# EAGLE design line_sensor (EAGLE 9.6.0)
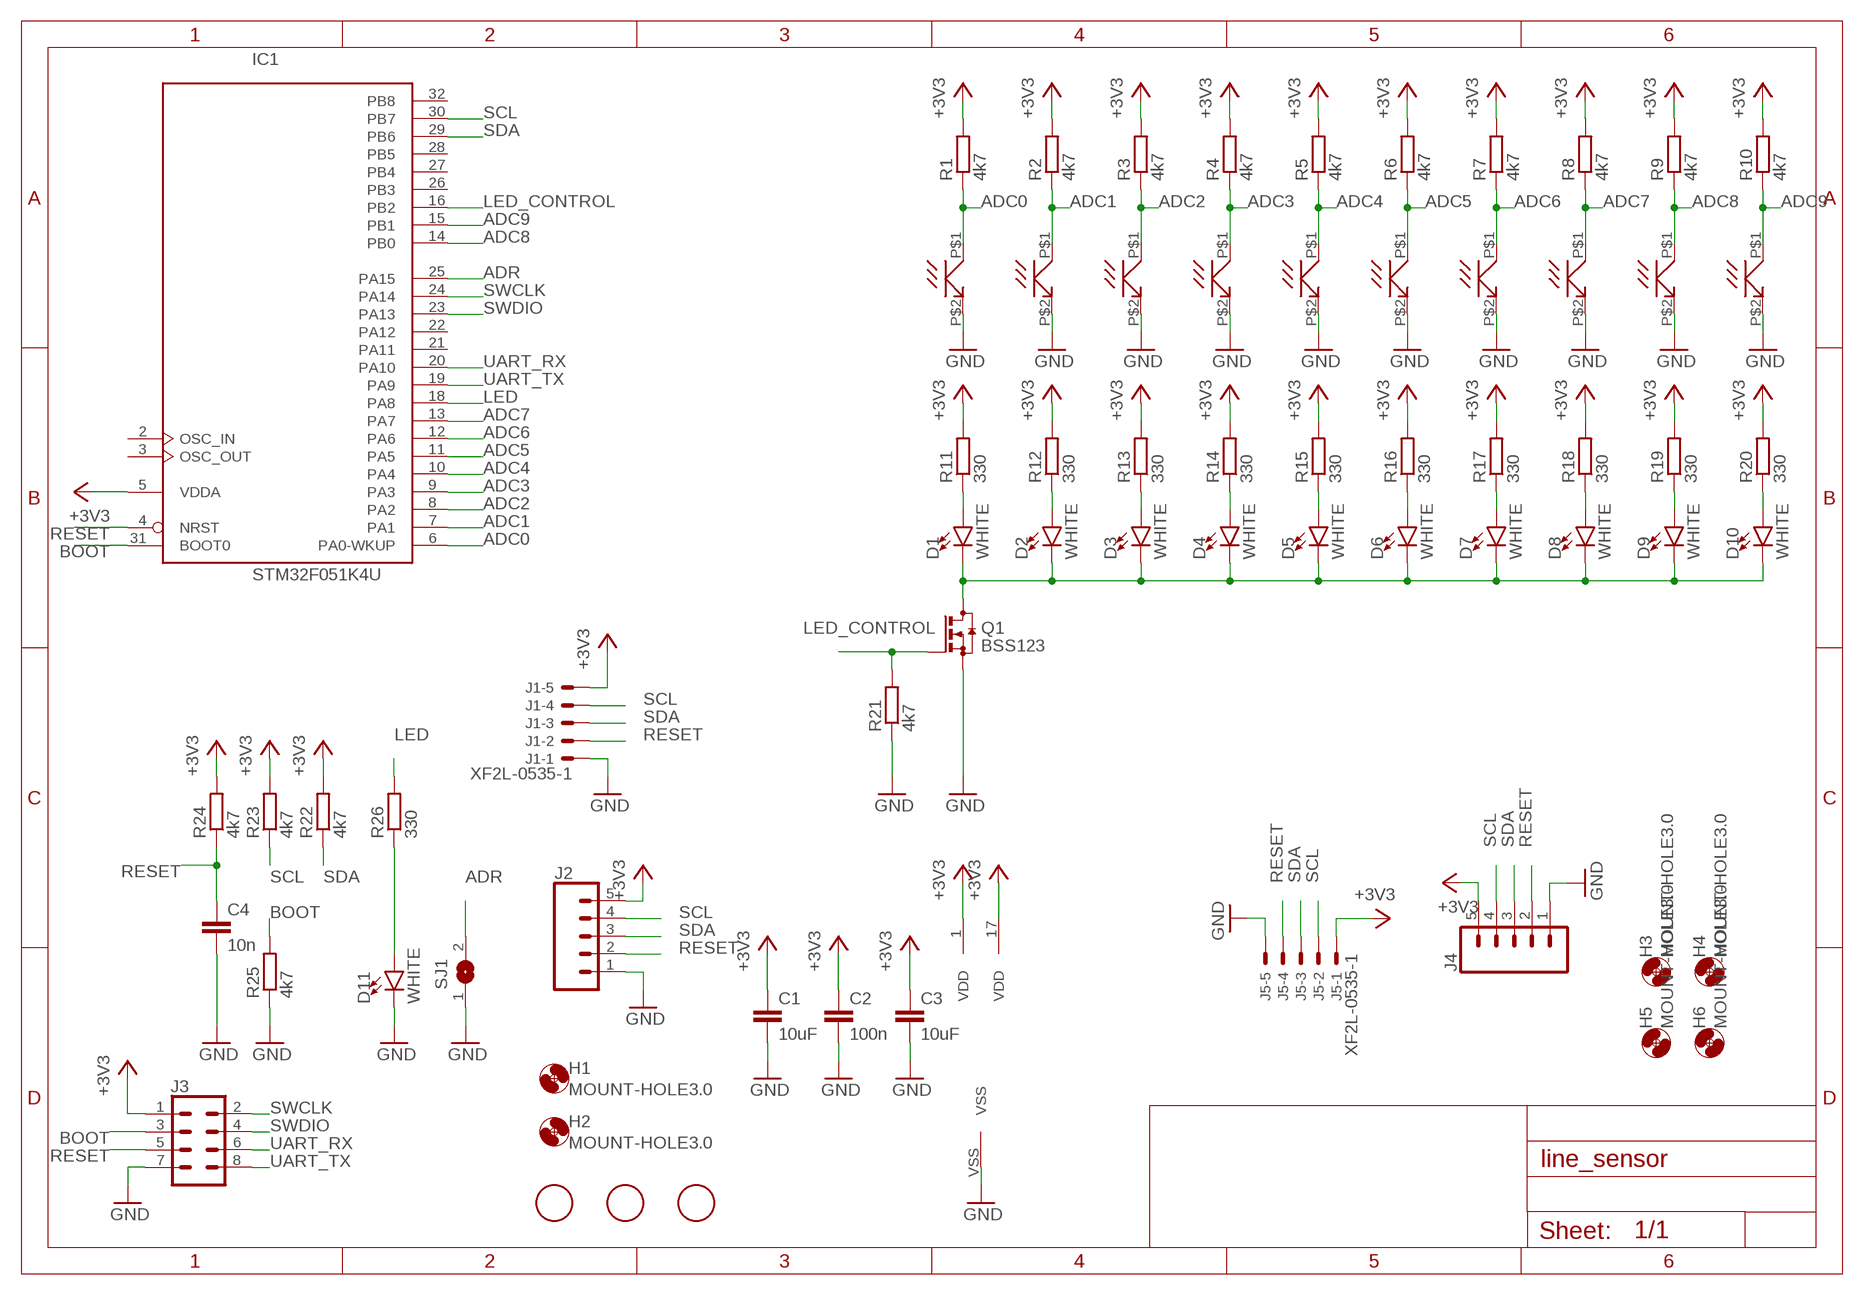
[diagram p0: schematic, sheet 1]

## Parts
C1  10uF  C-EUC0805K  [C0805K]
C2  100n  C-EUC0805K  [C0805K]
C3  10uF  C-EUC0805K  [C0805K]
C4  10n  C-EUC0805K  [C0805K]
D1  WHITE  LED-WHITE1206  [LED-1206]
D2  WHITE  LED-WHITE1206  [LED-1206]
D3  WHITE  LED-WHITE1206  [LED-1206]
D4  WHITE  LED-WHITE1206  [LED-1206]
D5  WHITE  LED-WHITE1206  [LED-1206]
D6  WHITE  LED-WHITE1206  [LED-1206]
D7  WHITE  LED-WHITE1206  [LED-1206]
D8  WHITE  LED-WHITE1206  [LED-1206]
D9  WHITE  LED-WHITE1206  [LED-1206]
D10  WHITE  LED-WHITE1206  [LED-1206]
D11  WHITE  LED-WHITE1206  [LED-1206]
H1  MOUNT-HOLE3.0  [3,0]
H2  MOUNT-HOLE3.0  [3,0]
H3  MOUNT-HOLE3.0  [3,0]
H4  MOUNT-HOLE3.0  [3,0]
H5  MOUNT-HOLE3.0  [3,0]
H6  MOUNT-HOLE3.0  [3,0]
IC1  STM32F051K4U  [UFQFPN32]
J1  XF2L-0535-1  [XF2L-0535-1]
J2  CONN_05  [1X05]
J3  CONN_04X2  [2X4]
J4  CONN_05  [1X05]
J5  XF2L-0535-1  [XF2L-0535-1]
Q1  BSS123  [SOT23]
R1  4k7  R-EU_M0805  [M0805]
R2  4k7  R-EU_M0805  [M0805]
R3  4k7  R-EU_M0805  [M0805]
R4  4k7  R-EU_M0805  [M0805]
R5  4k7  R-EU_M0805  [M0805]
R6  4k7  R-EU_M0805  [M0805]
R7  4k7  R-EU_M0805  [M0805]
R8  4k7  R-EU_M0805  [M0805]
R9  4k7  R-EU_M0805  [M0805]
R10  4k7  R-EU_M0805  [M0805]
R11  330  R-EU_M0805  [M0805]
R12  330  R-EU_M0805  [M0805]
R13  330  R-EU_M0805  [M0805]
R14  330  R-EU_M0805  [M0805]
R15  330  R-EU_M0805  [M0805]
R16  330  R-EU_M0805  [M0805]
R17  330  R-EU_M0805  [M0805]
R18  330  R-EU_M0805  [M0805]
R19  330  R-EU_M0805  [M0805]
R20  330  R-EU_M0805  [M0805]
R21  4k7  R-EU_M0805  [M0805]
R22  4k7  R-EU_M0805  [M0805]
R23  4k7  R-EU_M0805  [M0805]
R24  4k7  R-EU_M0805  [M0805]
R25  4k7  R-EU_M0805  [M0805]
R26  330  R-EU_M0805  [M0805]
SJ1  SJ  [SJ]
U$1  SFH3710  [SFH710]
U$2  SFH3710  [SFH710]
U$3  SFH3710  [SFH710]
U$4  SFH3710  [SFH710]
U$5  SFH3710  [SFH710]
U$6  SFH3710  [SFH710]
U$7  SFH3710  [SFH710]
U$8  SFH3710  [SFH710]
U$9  SFH3710  [SFH710]
U$10  SFH3710  [SFH710]
U$11  FIDUCIAL  [FIDUCIAL_1MM]
U$12  FIDUCIAL  [FIDUCIAL_1MM]
U$13  FIDUCIAL  [FIDUCIAL_1MM]

## Nets
+3V3: C1.1 C2.1 C3.1 IC1.1(VDD) IC1.5(VDDA) IC1.17(VDD) J1.5 J2.5 J3.1 J4.5 J5.1 R1.2 R2.2 R3.2 R4.2 R5.2 R6.2 R7.2 R8.2 R9.2 R10.2 R11.2 R12.2 R13.2 R14.2 R15.2 R16.2 R17.2 R18.2 R19.2 R20.2 R22.2 R23.2 R24.2
ADC0: IC1.6(PA0-WKUP) R1.1 U$1.P$1(C)
ADC1: IC1.7(PA1) R2.1 U$2.P$1(C)
ADC2: IC1.8(PA2) R3.1 U$3.P$1(C)
ADC3: IC1.9(PA3) R4.1 U$4.P$1(C)
ADC4: IC1.10(PA4) R5.1 U$5.P$1(C)
ADC5: IC1.11(PA5) R6.1 U$6.P$1(C)
ADC6: IC1.12(PA6) R7.1 U$7.P$1(C)
ADC7: IC1.13(PA7) R8.1 U$8.P$1(C)
ADC8: IC1.14(PB0) R9.1 U$9.P$1(C)
ADC9: IC1.15(PB1) R10.1 U$10.P$1(C)
ADR: IC1.25(PA15) SJ1.2
BOOT: IC1.31(BOOT0) J3.3 R25.2
GND: C1.2 C2.2 C3.2 C4.2 D11.C IC1.VSS J1.1 J2.1 J3.7 J4.1 J5.5 Q1.2(S) R21.1 R25.1 SJ1.1 U$1.P$2(E) U$2.P$2(E) U$3.P$2(E) U$4.P$2(E) U$5.P$2(E) U$6.P$2(E) U$7.P$2(E) U$8.P$2(E) U$9.P$2(E) U$10.P$2(E)
LED: IC1.18(PA8) R26.2
LED_CONTROL: IC1.16(PB2) Q1.1(G) R21.2
N$1: D1.A R11.1
N$2: D2.A R12.1
N$3: D3.A R13.1
N$4: D4.A R14.1
N$5: D5.A R15.1
N$6: D6.A R16.1
N$7: D7.A R17.1
N$8: D8.A R18.1
N$9: D9.A R19.1
N$10: D10.A R20.1
N$11: D1.C D2.C D3.C D4.C D5.C D6.C D7.C D8.C D9.C D10.C Q1.3(D)
N$12: D11.A R26.1
RESET: C4.1 IC1.4(NRST) J1.2 J2.2 J3.5 J4.2 J5.4 R24.1
SCL: IC1.30(PB7) J1.4 J2.4 J4.4 J5.2 R23.1
SDA: IC1.29(PB6) J1.3 J2.3 J4.3 J5.3 R22.1
SWCLK: IC1.24(PA14) J3.2
SWDIO: IC1.23(PA13) J3.4
UART_RX: IC1.20(PA10) J3.6
UART_TX: IC1.19(PA9) J3.8
Unconnected: IC1.2(OSC_IN) IC1.3(OSC_OUT) IC1.21(PA11) IC1.22(PA12) IC1.26(PB3) IC1.27(PB4) IC1.28(PB5) IC1.32(PB8)

## Library data of the parts
C1-C4 = rcl:C-EU: CAPACITOR, European symbol; SPICEPREFIX: C
D1-D11 = SparkFun-LED:LED-WHITE: White SMD LED Used in manufacturing several products at SparkFun. Packages: 0603 - Bright White SMD 0603 package[Product Link] <http://www.kingbrightusa.com/product.asp?catalog_name=LED&product_id=APT1608QWF/D> 1206 - Bright White SMD1206 package [Product Link] <http://www.kingbrightusa.com/product.asp?catalog_name=LED&product_id=APT3216QWF/D> 3014 - Super Bright SMD 3014 package [Datasheet] <http://www.lumileds.com/uploads/459/DS208-pdf> SparkFun Products: Blackberry Trackballer Breakout <https://www.sparkfun.com/products/13169> Digital SandBox <https://www.sparkfun.com/products/12651>; PROD_ID: DIO-09955
H1-H6 = holes:MOUNT-HOLE: MOUNTING HOLE with drill center marker
IC1 = micro-stm_v3:STM32F051K*U: ARM 32-bit Cortex™-M0 CPU 48 MHz maximum frequency 16 to 64 Kbytes of Flash memory 4 to 8 kbytes of SRAM 27 GPIOs 2.0 to 3.6 V application supply
J1 J5 = con-omron:XF2*-05?: OMRON FPC Connector Source : http://www.omron.com/ecb/products/pdf/fpc.pdf; MPN: XF2L-0535-1A; OC_FARNELL: unknown; OC_NEWARK: 37M0863
J2 J4 = SparkFun-Connectors:CONN_05: Multi connection point. Often used as Generic Header-pin footprint for 0.1 inch spaced/style header connections On any of the 0.1 inch spaced packages, you can populate with these: Break Away Headers - Straight <https://www.sparkfun.com/products/116> (PRT-00116) Break Away Male Headers - Right Angle <https://www.sparkfun.com/products/553> (PRT-00553) Female Headers <https://www.sparkfun.com/products/115> (PRT-00115) Break Away Headers - Machine Pin <https://www.sparkfun.com/products/117> (PRT-00117) Break Away Female Headers - Swiss Machine Pin <https://www.sparkfun.com/products/743> (PRT-00743) For SCREWTERMINALS and SPRING TERMINALS visit here: Screw Terimnals on SparkFun.com <https://www.sparkfun.com/search/results?term=Screw+Terminals> (5mm/3.5mm/2.54mm spacing) This device is also useful as a general connection point to wire up your design to another part of your project. Our various solder wires solder well into these plated through hole pads. Hook-Up Wire - Assortment (Stranded, 22 AWG) <https://www.sparkfun.com/products/11375> (PRT-11375) Hook-Up Wire - Assortment (Solid Core, 22 AWG) <https://www.sparkfun.com/products/11367> (PRT-11367) View the entire wire category on our website here <https://www.sparkfun.com/categories/141> Special notes: Molex polarized connector foot print use with SKU : PRT-08231 with associated crimp pins and housings. 1MM SMD Version SKU: PRT-10208
J3 = SparkFun-Connectors:CONN_04X2: Multi connection point. Often used as Generic Header-pin footprint for 0.1 inch spaced/style header connections On any of the 0.1 inch spaced packages, you can populate with these: Break Away Headers - Straight <https://www.sparkfun.com/products/116> (PRT-00116) Break Away Male Headers - Right Angle <https://www.sparkfun.com/products/553> (PRT-00553) Female Headers <https://www.sparkfun.com/products/115> (PRT-00115) Break Away Headers - Machine Pin <https://www.sparkfun.com/products/117> (PRT-00117) Break Away Female Headers - Swiss Machine Pin <https://www.sparkfun.com/products/743> (PRT-00743)
Q1 = transistor-small-signal:BSS123: N-CHANNEL MOS FET
R1-R26 = rcl:R-EU_: RESISTOR, European symbol; SPICEPREFIX: R
SJ1 = jumper:SJ: SMD solder JUMPER
U$1-U$10 = my_library:SFH3710
U$11-U$13 = borkedlabs-misc:FIDUCIAL: For use by pick and place machines to calibrate the vision/machine, 1mm By microbuilder.eu

## Board
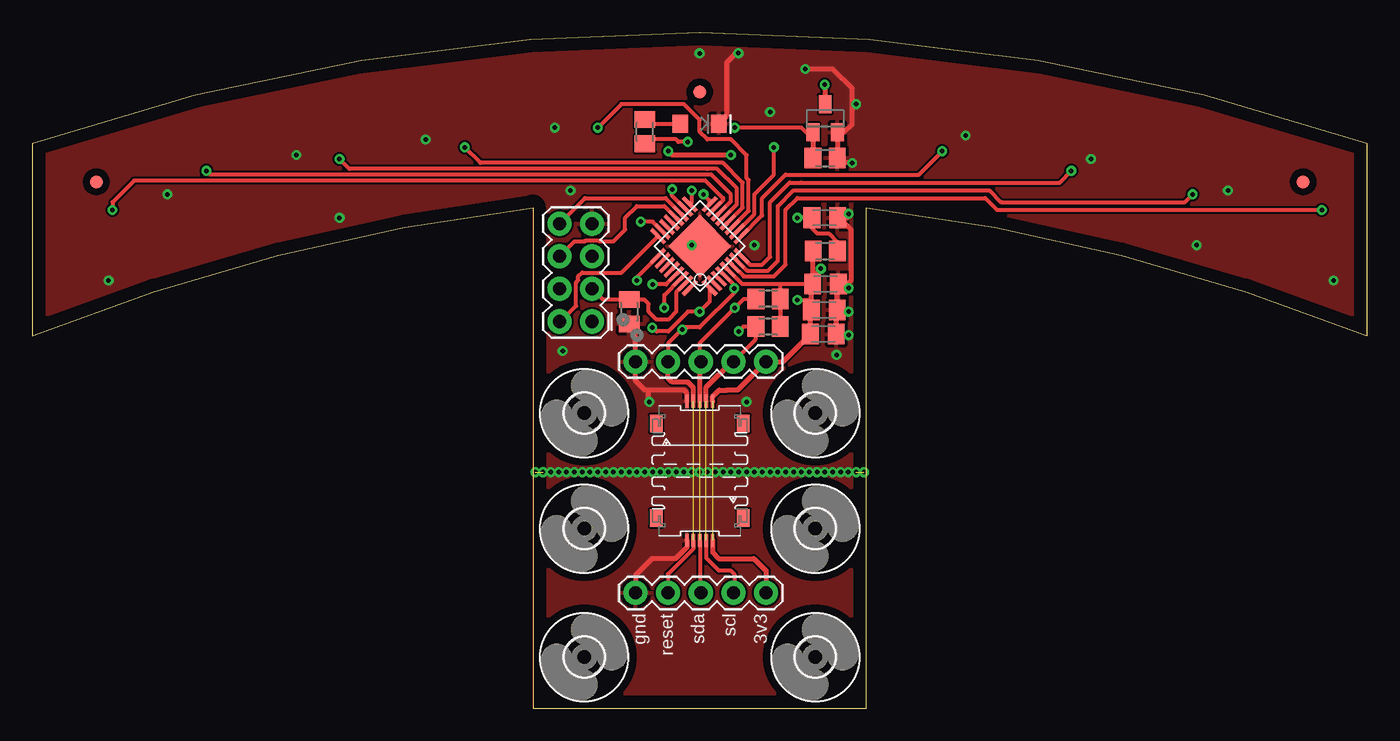
[diagram p1: board, top side]
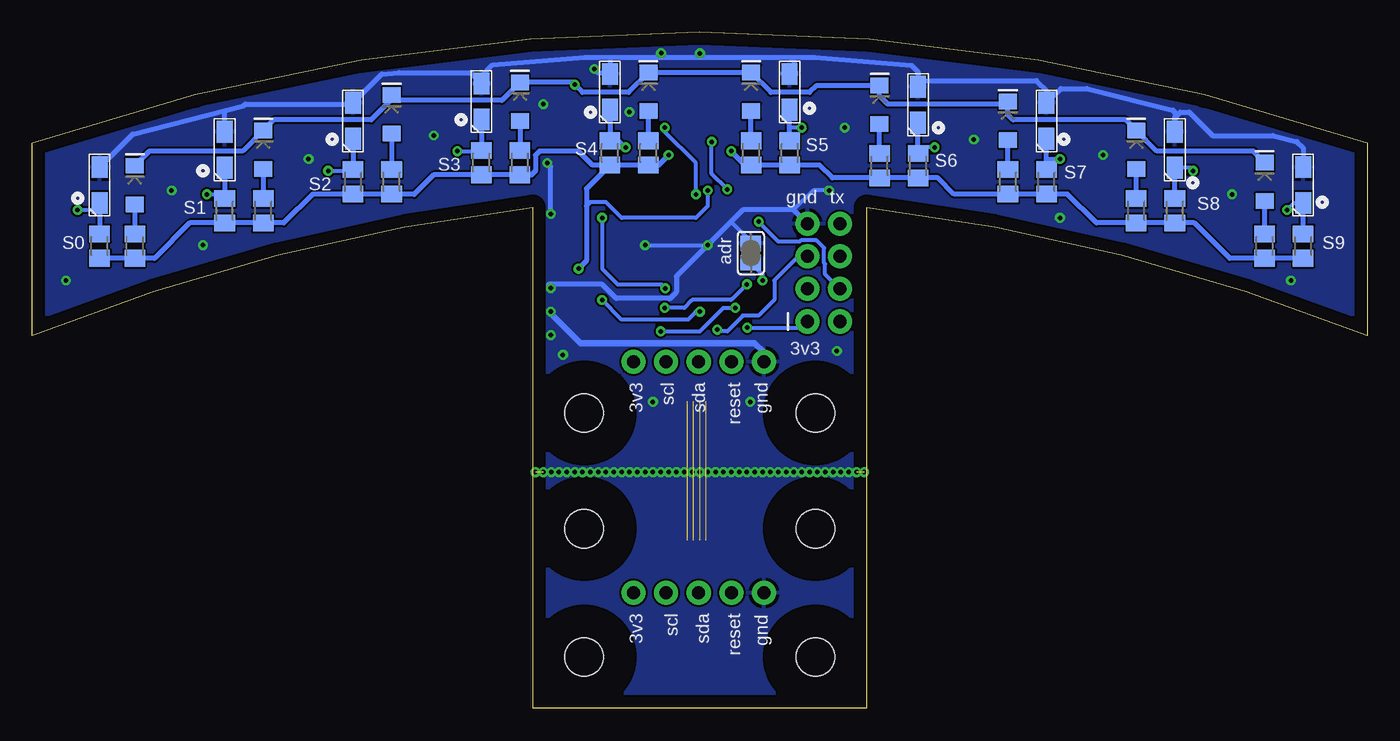
[diagram p2: board, bottom side, seen from below]

Size 104 x 52.66 mm. Coordinates in mm from the lower left corner, seen from the top.
Outline: 39,0 65,0 65,39 arc-15 104,29 104,44 arc38 0,44 0,29 arc-15 39,39 39,0
Copper layers (1*16): Top 0.035mm / dielectric 1.5mm / Bottom 0.035mm
Design rules "default": minimum track width 6mil, minimum drill 0.35mm, track to track 6mil, track to pad 6mil, pad to pad 6mil, via to via 6mil, smd to smd 6mil, copper to edge 40mil, drill to drill 6mil, minimum pad ring 10mil, minimum via ring 8mil, stop-mask expansion 4mil, vias tented up to drill 0mil, thermal gap 10mil

### Footprints (pad centres in the part's own frame; a part is rotated, then mirrored left to right if it is on the bottom)
C0805K = smd 1.3 x 1.6: 1 -1,0; 2 1,0
LED-1206 = smd 1.2 x 1.4: A -1.5,0; C 1.5,0
3,0 = hole 3: 0,0
UFQFPN32 = smd 1.5 x 0.3: 1 -2.85,1.75; 2 -2.85,1.25; 3 -2.85,0.75; 4 -2.85,0.25; 5 -2.85,-0.25; 6 -2.85,-0.75; 7 -2.85,-1.25; 8 -2.85,-1.75; 17 2.85,-1.75; 18 2.85,-1.25; 19 2.85,-0.75; 20 2.85,-0.25; 21 2.85,0.25; 22 2.85,0.75; 23 2.85,1.25; 24 2.85,1.75 | smd 0.3 x 1.5: 9 -1.75,-2.85; 10 -1.25,-2.85; 11 -0.75,-2.85; 12 -0.25,-2.85; 13 0.25,-2.85; 14 0.75,-2.85; 15 1.25,-2.85; 16 1.75,-2.85; 25 1.75,2.85; 26 1.25,2.85; 27 0.75,2.85; 28 0.25,2.85; 29 -0.25,2.85; 30 -0.75,2.85; 31 -1.25,2.85; 32 -1.75,2.85 | smd 3.45 x 3.45: VSS 0,0
XF2L-0535-1 = smd 1 x 0.25: 1 1.905,1; 2 1.905,0.5; 3 1.905,0; 4 1.905,-0.5; 5 1.905,-1 | smd 1.34 x 1: M1 0.18,3.388; M2 0.18,-3.388
1X05 = drill 1.016 pad 1.88: 1 0,0; 2 2.54,0; 3 5.08,0; 4 7.62,0; 5 10.16,0
2X4 = drill 1.016 pad 1.88: 1 -3.81,-1.27; 2 -3.81,1.27; 3 -1.27,-1.27; 4 -1.27,1.27; 5 1.27,-1.27; 6 1.27,1.27; 7 3.81,-1.27; 8 3.81,1.27
SOT23 = smd 1 x 1.4: 1 -0.95,-1.1; 2 0.95,-1.1; 3 0,1.1
M0805 = smd 1.3 x 1.6: 1 -0.95,0; 2 0.95,0
SJ = smd 1.168 x 1.6: 1 -0.762,0; 2 0.762,0
SFH710 = smd 1.7 x 1.25: P$1 -1.4,0; P$2 1.4,0
FIDUCIAL_1MM = smd 1 x 1: 1 0,0

### Placement (x,y rotation side)
C1  61.81,33.06 0 top
C2  61.63,29.15 0 top
C3  61.7,31.03 0 top
C4  61.74,38.2 0 top
D1  96,40.75 90 bottom
D2  86,43.5 90 bottom
D3  76,46.25 90 bottom
D4  66,47.25 90 bottom
D5  56,48 90 bottom
D6  48,48 90 bottom
D7  38,47 90 bottom
D8  28,45.75 90 bottom
D9  18,43.5 90 bottom
D10  8,41 90 bottom
D11  51.99,45.52 0 top
H1  43,23 0 top
H2  61,23 0 top
H3  43,14 0 top
H4  61,14 0 top
H5  43,4 0 top
H6  61,4 0 top
IC1  52,36 135 top
J1  52,22 90 top
J2  47,27 0 top
J3  42.35,33.94 90 top
J4  47,9 0 top
J5  52,15 270 top
Q1  61.77,45.95 0 top
R1  98.75,36 270 bottom
R2  89,38.75 270 bottom
R3  79,41 270 bottom
R4  69,42.5 270 bottom
R5  59,43.25 270 bottom
R6  45,43.25 270 bottom
R7  35,42.25 270 bottom
R8  25,41 270 bottom
R9  15,38.75 270 bottom
R10  5,36 270 bottom
R11  96,36 270 bottom
R12  86,38.75 270 bottom
R13  76,41 270 bottom
R14  66,42.5 270 bottom
R15  56,43.25 270 bottom
R16  48,43.25 270 bottom
R17  38,42.25 270 bottom
R18  28,41 270 bottom
R19  18,38.75 270 bottom
R20  8,36 270 bottom
R21  61.77,42.86 180 top
R22  57.33,31.89 0 top
R23  57.33,29.72 0 top
R24  61.78,35.6 180 top
R25  46.5,30.89 90 top
R26  47.72,44.91 270 top
SJ1  48.02,35.46 270 bottom
U$1  98.75,40.75 90 bottom
U$2  89,43.5 90 bottom
U$3  79,45.75 90 bottom
U$4  69,47.25 90 bottom
U$5  59,48 90 bottom
U$6  45,48 90 bottom
U$7  35,47 90 bottom
U$8  25,45.75 90 bottom
U$9  15,43.5 90 bottom
U$10  5,40.75 90 bottom
U$11  52,48 0 top
U$12  5,41 0 top
U$13  99,41 0 top

### Tracks (layer width: path | path; a pad name or v marks a point on that pad's centre or on a via)
+3V3  (via drill 0.35)  (1 unrouted)
  Top 0.305: J2.5 57.36,27.2 | R22.2 R23.2 58.28,32.95 58.39,33.06 | IC1.5 55.29,33.06 58.39,33.06 | 58.39,33.06 C1.1 | IC1.1 52.78,31.68 v51.99,30.89 51.07,30.89 49.55,29.36 48.63,29.36 48.33,29.67 v48.3,29.64 | v59.61,31.8 60.7,31.8 | 51.07,39.4 IC1.17 51.38,39.41 v51.38,40.34
  Top 0.406: J1.5 53,24.28 53.51,24.79 54.12,24.79 54.95,24.79 J2.5 58.48,27 C2.1 60.63,30.96 C3.1 60.7,31.8 60.7,32.95 C1.1 60.81,33.33 | 60.81,33.33 60.81,35.58 R24.2 | v61.44,34.24 60.81,33.61 60.81,33.33 | v54.43,43.08 49.85,43.08 v49.55,43.38 | J5.1 53,12.14 53.47,11.67 56.22,11.67 57.16,10.72 J4.5
  Bottom 0.305: v51.99,30.89 52.29,30.89 52.9,30.28 58.08,30.28 v59.61,31.8 | v48.3,29.64 44.1,29.64 J3.1 | v51.38,40.34 51.38,39.12 52.29,38.2 58.08,38.2 59.3,39.42 60.52,39.42 60.83,39.12
  Bottom 0.406: R10.2 R20.2 10.73,35.05 13.48,37.8 R9.2 R19.2 21.11,37.8 23.36,40.05 R8.2 R18.2 32.19,40.05 33.44,41.3 R7.2 R17.2 41.67,41.3 42.67,42.3 R6.2 R16.2 48.47,42.3 v49.55,43.38 | R5.2 R15.2 55.2,42.3 v54.43,43.08 | 65.4,41.55 R14.2 | R14.2 R4.2 72.72,41.55 74.24,40.03 75.98,40.03 R13.2 R3.2 82.14,40.05 84.39,37.8 R12.2 R2.2 91.71,37.8 94.46,35.05 R11.2 R1.2 | R5.2 60.83,40.47 60.83,39.12 60.83,34.85 v61.44,34.24 | R5.2 60.35,42.3 61.44,43.38 64.48,43.38 64.79,43.08 64.79,41.86 65.1,41.55 R14.2
ADC0  (via drill 0.35)
  Top 0.305: IC1.6 55.43,33.63 57.78,33.63 58.69,34.55 58.69,38.81 59.61,39.73 74.24,39.73 75.15,38.81 v100.45,38.81
  Bottom 0.305: v100.45,38.81 99.29,38.81 U$1.P$1
  Bottom 0.406: U$1.P$1 R1.1
ADC1  (via drill 0.35)
  Top 0.305: IC1.7 55.68,34.09 57.32,34.09 58.08,34.85 58.08,39.12 59.3,40.34 74.54,40.34 75.46,39.42 89.78,39.42 v90.39,40.03
  Bottom 0.305: v90.39,40.03 89,40.03
  Bottom 0.406: U$2.P$1 89,40.03 R2.1
ADC2  (via drill 0.35)
  Top 0.305: IC1.8 55.93,34.55 56.86,34.55 57.47,35.15 57.47,39.42 59,40.95 59.91,40.95 80.03,40.95 v80.94,41.86
  Bottom 0.305: v80.94,41.86 79.09,41.86 R3.1
  Bottom 0.406: U$3.P$1 R3.1
ADC3  (via drill 0.35)
  Top 0.305: IC1.9 56.86,38.39 56.86,39.73 58.69,41.55 69.06,41.55 v70.89,43.38
  Bottom 0.305: v70.89,43.38 69.07,43.38 R4.1
  Bottom 0.406: U$4.P$1 R4.1
ADC4  (via drill 0.35)
  Top 0.305: IC1.10 56.25,38.49 56.25,40.03 57.78,41.55 v57.78,43.69
  Bottom 0.305: v57.78,43.69 58.29,44.2 R5.1
  Bottom 0.406: U$5.P$1 R5.1
ADC5  (via drill 0.35)
  Top 0.305: v44.06,45.21 45.89,47.04 50.77,47.04 51.99,45.82 51.99,44.91 52.6,44.3 54.43,44.3 55.65,43.08 55.65,41.29 55.8,41.13 55.8,38.74 IC1.11
  Bottom 0.305: v44.06,45.21 45,45.21
  Bottom 0.406: R6.1 45,45.21 45,45.85 45.28,46.13 45.28,46.32 U$6.P$1
ADC6  (via drill 0.35)
  Top 0.305: v33.7,43.69 34.92,42.47 53.82,42.47 55.34,40.95 55.34,38.99 IC1.12
  Bottom 0.305: v33.7,43.69 34.51,43.69 R7.1
  Bottom 0.406: R7.1 U$7.P$1
ADC7  (via drill 0.35)
  Top 0.305: v23.95,42.77 24.71,42.01 52.6,42.01 53.36,42.01 54.88,40.49 54.88,39.24 IC1.13
  Bottom 0.305: v23.95,42.77 25,42.77
  Bottom 0.406: R8.1 25,42.77 U$8.P$1
ADC8  (via drill 0.35)
  Top 0.305: IC1.14 54.43,39.49 54.43,40.03 52.9,41.55 13.89,41.55 v13.58,41.86
  Bottom 0.305: v13.58,41.86 13.82,42.1 U$9.P$1
  Bottom 0.406: R9.1 U$9.P$1
ADC9  (via drill 0.35)
  Top 0.305: IC1.15 53.82,39.58 53.82,39.73 52.44,41.1 7.94,41.1 6.27,39.42 v6.27,38.81
  Bottom 0.305: U$10.P$1 5.73,39.35 v6.27,38.81
  Bottom 0.406: R10.1 U$10.P$1
ADR  (via drill 0.35)
  Top 0.305: IC1.25 47.11,33.59 v47.11,33.33
  Bottom 0.305: v47.11,33.33 47.11,33.78 SJ1.2
BOOT
  Top 0.305: J3.3 44.45,31.84 R25.2 47.68,31.84 48.02,31.5 48.02,30.89 48.63,30.28 49.55,30.28 50.16,30.89 50.16,32.39 IC1.31
GND  (via drill 0.35)  (2 unrouted)
  Top 0.406: J1.1 51,24.56 50.77,24.79 48.02,24.79 | 48.02,24.79 47.72,24.79 47,25.51 J2.1 47,29.44 R25.1 | 62.7,32.95 C3.2 62.63,30.96 C2.2 62.72,29.06 v63.61,29.06 | 62.7,32.95 C1.2 | C4.2 62.87,38.2 63.78,37.29 63.78,33.33 63.41,32.95 62.7,32.95 | IC1.VSS 51.45,36 v51.38,36.07 | v63.61,32.72 63.37,32.95 62.7,32.95 | D11.C 54.12,46.15 54.12,50.31 55,51.19 55.01,51.18 v55.01,51.01 | v60.22,49.78 62.35,49.78 63.87,48.26 63.87,45.52 63.2,44.85 Q1.2 R21.1 63.11,42.47 v63.87,42.47 | 62.72,38.23 C4.2 | v48.06,23.88 48.02,23.91 48.02,24.79 | C4.2 63.48,38.2 63.78,38.51 v63.61,38.51 | J5.5 51,12.55 50.12,11.67 48.29,11.67 47,10.38 J4.1
  Top 0.508: v63.61,30.89 62.7,30.89 62.63,30.96
  Bottom 0.305: v56.25,36.07 v51.38,36.07 | v41.93,40.34 43.16,40.34 44.69,38.81 | SJ1.1 48.02,36.37 49.55,37.9
  Bottom 0.406: v63.61,32.72 63.78,32.89 63.78,33.02 59.61,33.02 58.51,31.93 54.43,31.93 54.36,31.86 53.82,32.41 53.82,33.63 v51.38,36.07 49.55,37.9 48.63,38.81 44.69,38.81 J3.7 | U$1.P$2 96.18,44.72 88.9,46.56 | 88.9,46.56 87.54,46.91 87.4,47.04 79.11,47.04 U$3.P$2 76.76,49.39 75.43,49.5 69.85,49.5 U$4.P$2 69,49.23 68.13,50.1 60.94,50.7 59,50.7 | 59,50.7 59,49.48 | 59,49.48 U$5.P$2 | 59,50.7 54.73,50.7 | 54.73,50.7 44.98,50.7 | 44.98,50.7 44.67,50.39 44.67,49.73 U$6.P$2 | 44.98,50.7 43.06,50.7 35.51,50.08 35,49.56 U$7.P$2 34.53,48.87 25.77,48.87 24.86,47.96 24.86,47.29 U$8.P$2 23.89,48.26 21.83,48.26 15.15,46.57 15,46.43 U$9.P$2 15,46 14.57,46.43 13.88,46.43 12.06,44.6 7.35,44.6 5.49,44.13 5,43.64 U$10.P$2 | U$2.P$2 89,46.46 88.9,46.56 | v55.01,51.01 55.01,50.98 54.73,50.7 | v60.22,49.78 59.91,49.48 59,49.48 | v63.61,38.51 63.61,42.2 v63.87,42.47
  Bottom 0.508: J2.1 47,27.73 47.72,28.45 61.29,28.45 63.73,30.89 v63.61,30.89
  other vias: 40.71,45.21 30.65,44.3 20.59,43.08 10.53,40.03 72.71,44.6 82.47,42.77 93.14,40.34 55.64,23.88 51.99,51 90.7,36.07 62.66,27.53 41.32,27.84 23.95,38.2 5.96,33.33 101.36,33.33 64.18,47.04 57.47,46.43 39.19,18.39 39.8,18.39 40.4,18.39 41.01,18.39 41.62,18.39 42.23,18.39 42.84,18.39 43.45,18.39 44.06,18.39 44.67,18.39 45.28,18.39 45.89,18.39 46.5,18.39 47.11,18.39 47.72,18.39 48.33,18.39 48.94,18.39 49.55,18.39 50.16,18.39 50.77,18.39 51.38,18.39 51.99,18.39 52.6,18.39 53.21,18.39 53.82,18.39 54.43,18.39 55.04,18.39 55.64,18.39 56.25,18.39 56.86,18.39 57.47,18.39 58.08,18.39 58.69,18.39 59.3,18.39 59.91,18.39 60.52,18.39 61.13,18.39 61.74,18.39 62.35,18.39 62.96,18.39 63.57,18.39 64.18,18.39 64.79,18.39
  pour Bottom: -7.45,64.11 105.94,64.11 105.94,-0.2 -7.45,-0.2
  pour Top: -7.14,64.11 109.59,64.11 109.59,-0.81 -7.14,-0.81
LED  (via drill 0.35)
  Top 0.305: IC1.18 49.85,39.91 49.85,40.34 v49.85,40.41 | v51.07,44.12 50.34,44.12 50.16,44.3 48.06,44.3 R26.2
  Bottom 0.305: v49.85,40.41 51.07,41.63 v51.07,44.12
LED_CONTROL  (via drill 0.35)
  Top 0.305: R21.2 60.82,44.31 59.91,45.21 55.95,45.21 v54.73,45.21 | IC1.16 52.78,39.55 v52.29,40.03
  Top 0.406: Q1.1 60.83,44.84 60.83,42.77 60.82,42.78 R21.2
  Bottom 0.305: v52.29,40.03 52.29,42.47 54.73,44.91 v54.73,45.21
N$1
  Bottom 0.406: D1.A R11.1
N$2
  Bottom 0.406: D2.A R12.1
N$3
  Bottom 0.406: D3.A R13.1
N$4
  Bottom 0.406: D4.A R14.1
N$5
  Bottom 0.406: R15.1 D5.A
N$6
  Bottom 0.406: R16.1 D6.A
N$7
  Bottom 0.406: R17.1 D7.A
N$8
  Bottom 0.406: R18.1 D8.A
N$9
  Bottom 0.406: R19.1 D9.A
N$10
  Bottom 0.406: R20.1 D10.A
N$11  (via drill 0.35)
  Top 0.406: v61.74,48.57 61.77,48.54 Q1.3
  Bottom 0.406: D10.C 8.88,43.38 16.38,43.38 D9.C 18.82,45.82 27.6,45.82 28,46.22 D8.C 28.21,47.04 37.36,47.04 38,47.69 D7.C 42.91,48.5 43.45,47.96 46.46,47.96 D6.C D5.C 57.54,47.96 61.13,47.96 v61.74,48.57 61.92,48.75 D4.C 67.4,47.35 75.6,47.35 D3.C 76,47.41 77.59,45.82 85.18,45.82 D2.C 87.62,43.38 94.87,43.38 D1.C
N$12
  Top 0.305: R26.1 48.06,45.52 D11.A
RESET  (via drill 0.35)  (1 unrouted)
  Top 0.305: IC1.4 54.73,32.92 54.73,32.71 v54.67,32.71 54.73,32.66 54.73,32.41 51.99,29.67 51.07,29.67 | 51.07,29.67 50.77,29.67 49.54,28.44 49.54,26.62 | R24.1 62.73,36.3 62.05,36.98 61.13,36.98 60.74,37.37 C4.1 v59.61,38.2 | v50.64,29.49 50.82,29.67 51.07,29.67 | J5.4 51.5,12.44 49.51,10.45 49.51,9.03 J4.2
  Top 0.406: J1.2 51.5,24.97 51.07,25.4 49.85,25.4 49.54,25.71 49.54,26.62 J2.2
  Bottom 0.305: v59.61,38.2 59.61,34.24 58.39,33.02 54.98,33.02 v54.67,32.71 | J3.5 44.32,35.2 46.2,33.33 46.2,31.8 47.41,30.58 48.63,30.58 49.85,29.36 50.77,29.36 v50.64,29.49
SCL  (via drill 0.35)  (1 unrouted)
  Top 0.305: 54.39,27 J2.4 56.38,28.76 R23.1 55.39,29.72 v55.03,29.36 | v49.24,31.19 49.24,32.18 IC1.30 | J5.2 52.5,11.73 53.47,10.75 54.39,10.75 54.69,10.45 54.69,9.07 J4.4
  Top 0.406: J1.4 52.5,25 54.5,27 J2.4
  Bottom 0.305: v55.03,29.36 51.99,29.36 50.16,31.19 v49.24,31.19
SDA  (via drill 0.35)  (1 unrouted)
  Top 0.305: J2.3 51.99,27.09 51.99,28.45 v54.73,31.19 54.88,31.34 55.43,31.89 R22.1 | IC1.29 49.37,33.02 v48.33,33.02 | J5.3 52,9.08 J4.3
  Top 0.406: J1.3 52,26.92 J2.3
  Bottom 0.305: v48.33,33.02 49.48,31.88 49.53,31.88 49.6,31.8 52.6,31.8 53.21,31.19 v54.73,31.19
SWCLK
  Top 0.305: J3.2 41.17,30.12 42.38,31.33 42.38,33.18 42.54,33.34 42.54,33.63 42.84,33.94 45.91,33.94 IC1.24
SWDIO  (via drill 0.35)
  Top 0.305: IC1.23 48.33,37.9 v47.41,37.9
  Bottom 0.305: J3.4 42.23,33.82 42.23,34.6 42.33,34.69 42.33,35.85 42.92,36.45 44.14,36.45 44.21,36.37 45.89,36.37 v47.41,37.9
UART_RX
  Top 0.305: J3.6 42.23,36.36 42.23,36.37 43.03,36.37 43.1,36.45 44.14,36.45 44.21,36.37 45.28,36.37 46.2,37.29 46.2,38.2 47.11,39.12 49.24,39.12 IC1.20
UART_TX
  Top 0.305: J3.8 43.06,39.73 49.33,39.73 IC1.19

### Text on the board
tNames: gnd | reset | sda | scl | 3v3
bNames: S5 | S4 | S6 | S3 | S7 | tx | gnd | S2 | S8 | S1 | S9 | S0 | adr | 3v3 | gnd | reset | sda | scl | 3v3 | gnd | reset | sda | scl | 3v3
tTest: UART_TX | GND | UART_RX | RESET | SWDIO | BOOT | SWCLK | 3V3 | GND | RESET | SDA | SCL | 3V3
Measures: r = 150